# EAGLE design PiezoAmpBoard (EAGLE 7.4.0)
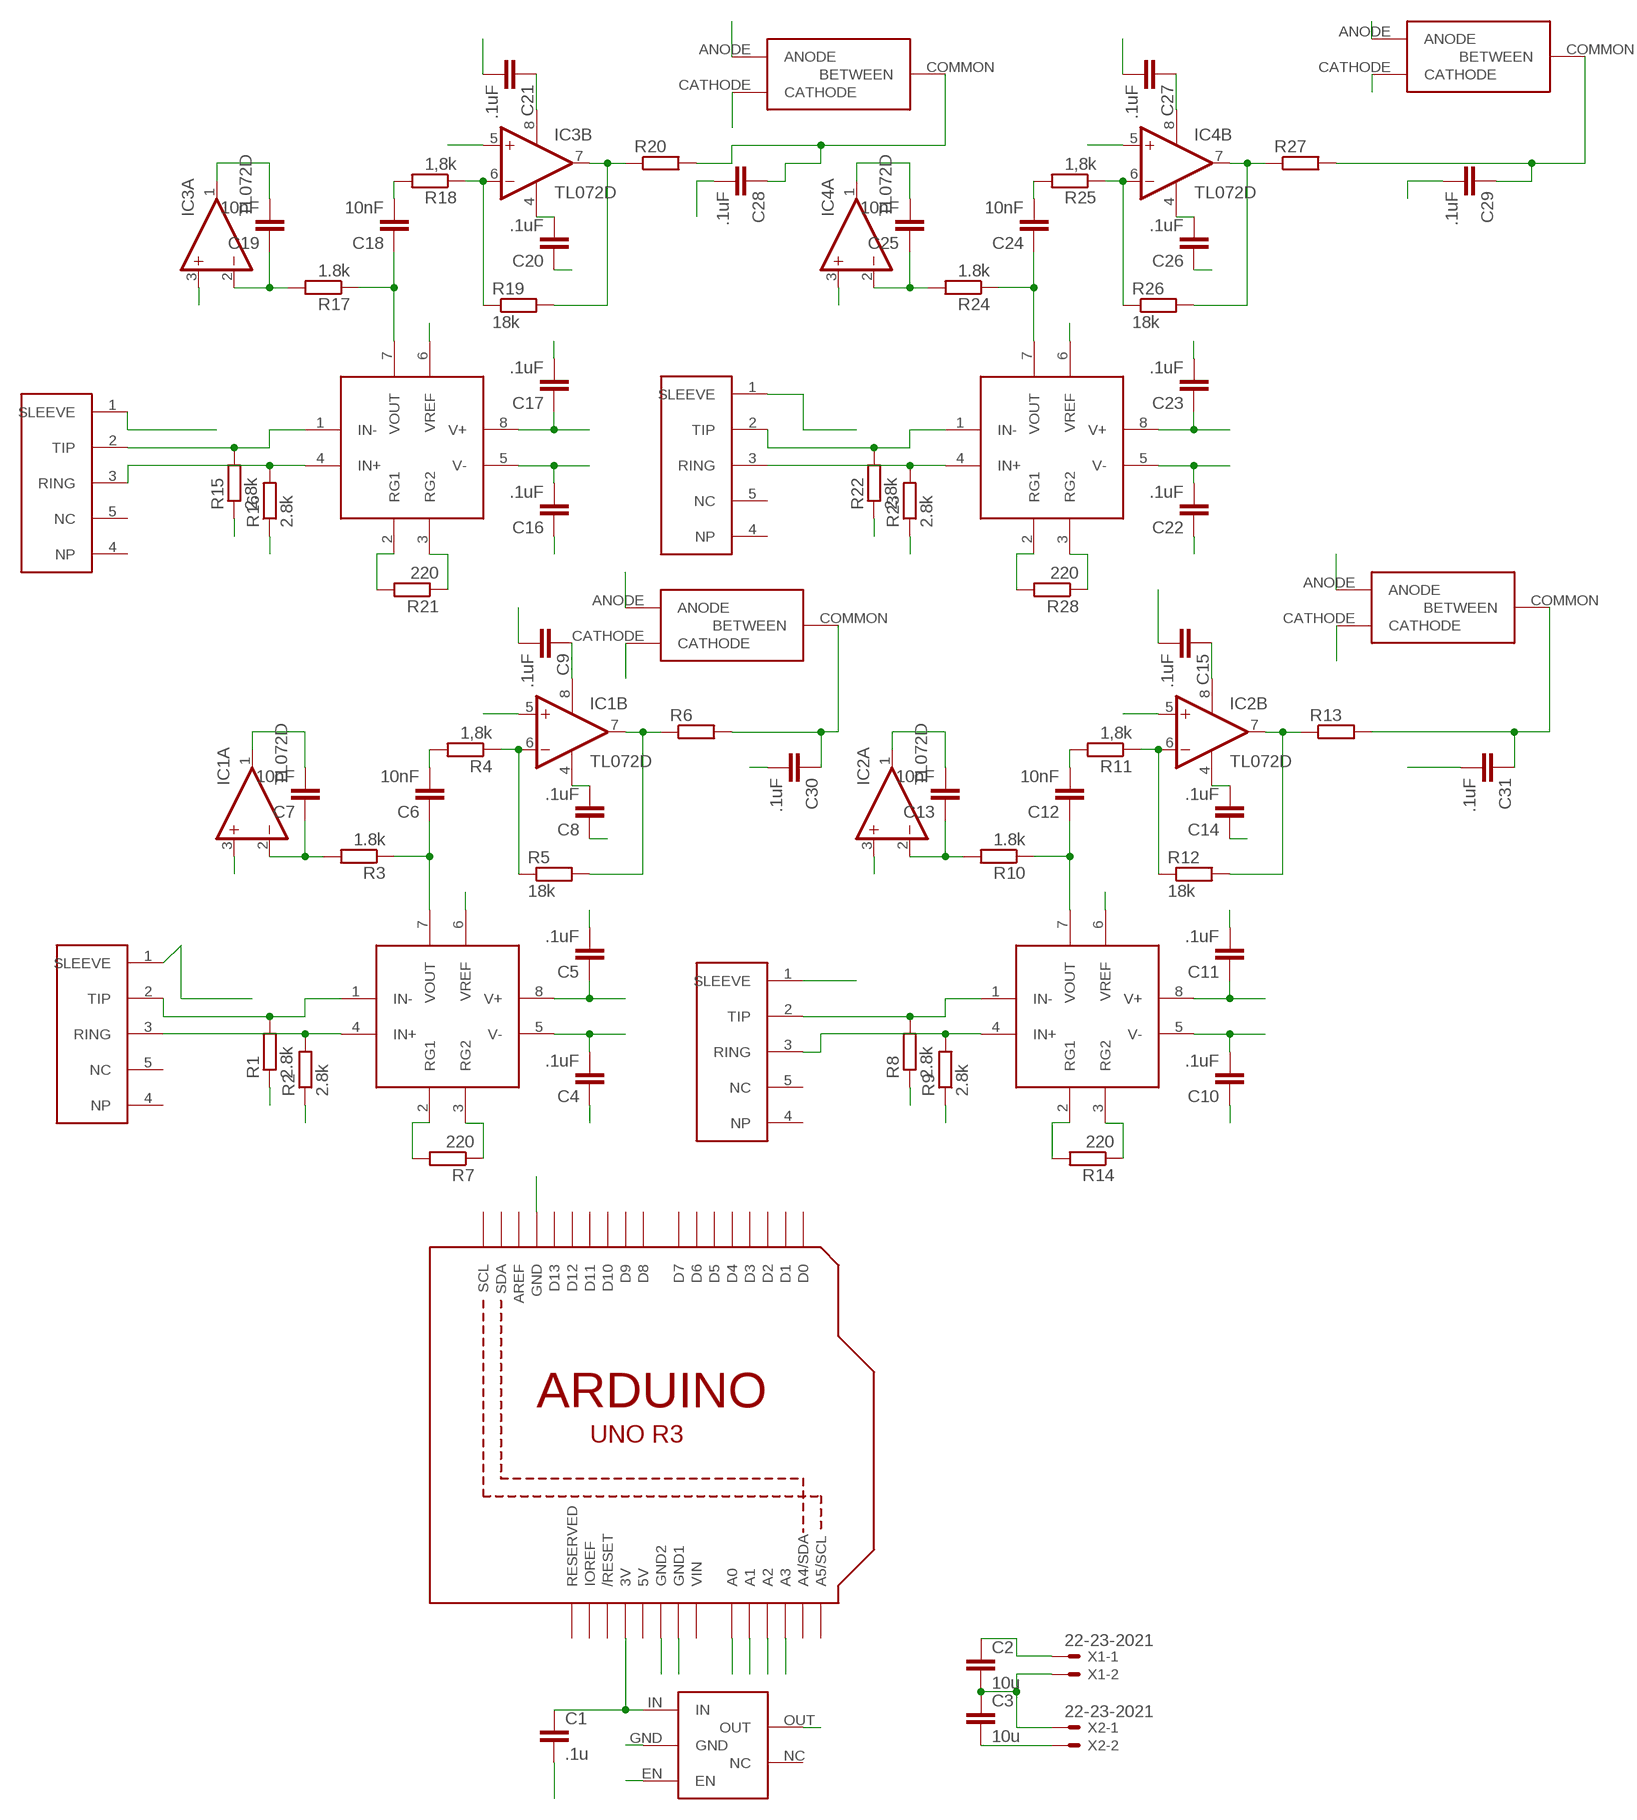
[diagram p0: schematic, sheet 1]

## Parts
C1  .1u  C-EUC0603  [C0603]
C2  10u  C-EUC0603  [C0603]
C3  10u  C-EUC0603  [C0603]
C4  .1uF  CC0603  [C0603]
C5  .1uF  CC0603  [C0603]
C6  10nF  CC0603  [C0603]
C7  10nF  CC0603  [C0603]
C8  .1uF  CC0603  [C0603]
C9  .1uF  CC0603  [C0603]
C10  .1uF  CC0603  [C0603]
C11  .1uF  CC0603  [C0603]
C12  10nF  CC0603  [C0603]
C13  10nF  CC0603  [C0603]
C14  .1uF  CC0603  [C0603]
C15  .1uF  CC0603  [C0603]
C16  .1uF  CC0603  [C0603]
C17  .1uF  CC0603  [C0603]
C18  10nF  CC0603  [C0603]
C19  10nF  CC0603  [C0603]
C20  .1uF  CC0603  [C0603]
C21  .1uF  CC0603  [C0603]
C22  .1uF  CC0603  [C0603]
C23  .1uF  CC0603  [C0603]
C24  10nF  CC0603  [C0603]
C25  10nF  CC0603  [C0603]
C26  .1uF  CC0603  [C0603]
C27  .1uF  CC0603  [C0603]
C28  .1uF  CC0603  [C0603]
C29  .1uF  CC0603  [C0603]
C30  .1uF  CC0603  [C0603]
C31  .1uF  CC0603  [C0603]
IC1  TL072D  [SO08]
IC2  TL072D  [SO08]
IC3  TL072D  [SO08]
IC4  TL072D  [SO08]
R1  2.8k  R-EU_R0603  [R0603]
R2  2.8k  R-EU_R0603  [R0603]
R3  1.8k  R-EU_R0603  [R0603]
R4  1,8k  R-EU_R0603  [R0603]
R5  18k  R-EU_R0603  [R0603]
R6  R-EU_R0603  [R0603]
R7  220  R-EU_R0603  [R0603]
R8  2.8k  R-EU_R0603  [R0603]
R9  2.8k  R-EU_R0603  [R0603]
R10  1.8k  R-EU_R0603  [R0603]
R11  1,8k  R-EU_R0603  [R0603]
R12  18k  R-EU_R0603  [R0603]
R13  R-EU_R0603  [R0603]
R14  220  R-EU_R0603  [R0603]
R15  2.8k  R-EU_R0603  [R0603]
R16  2.8k  R-EU_R0603  [R0603]
R17  1.8k  R-EU_R0603  [R0603]
R18  1,8k  R-EU_R0603  [R0603]
R19  18k  R-EU_R0603  [R0603]
R20  R-EU_R0603  [R0603]
R21  220  R-EU_R0603  [R0603]
R22  2.8k  R-EU_R0603  [R0603]
R23  2.8k  R-EU_R0603  [R0603]
R24  1.8k  R-EU_R0603  [R0603]
R25  1,8k  R-EU_R0603  [R0603]
R26  18k  R-EU_R0603  [R0603]
R27  R-EU_R0603  [R0603]
R28  220  R-EU_R0603  [R0603]
U1  ARDUINOR3-BPLACE  [ARDUINOR3-BPLACE]
U$1  TPS76316  [PDSO]
U$2  AD82216  [SOIC08]
U$3  AD82216  [SOIC08]
U$4  AD82216  [SOIC08]
U$5  AD82216  [SOIC08]
U$6  BAV99T  [SOT-523]
U$7  BAV99T  [SOT-523]
U$8  BAV99T  [SOT-523]
U$9  BAV99T  [SOT-523]
U$10  3MMJACK  [1X05]
U$11  3MMJACK  [1X05]
U$12  3MMJACK  [1X05]
U$13  3MMJACK  [1X05]
X1  22-23-2021  [22-23-2021]
X2  22-23-2021  [22-23-2021]

## Nets
3.3V: C1.1 U1.3V U$1.EN U$1.IN U$6.CATHODE U$7.CATHODE U$8.CATHODE U$9.CATHODE
GND: C1.2 U1.GND U1.GND1 U1.GND2 U$1.GND U$6.ANODE U$7.ANODE U$8.ANODE U$9.ANODE
N$1: R7.2 U$2.2(RG1)
N$2: R1.2 U$2.1(IN-) U$10.2(TIP)
N$3: R2.2 U$2.4(IN+) U$10.3(RING)
N$4: R7.1 U$2.3(RG2)
N$5: C6.1 R3.1 U$2.7(VOUT)
N$6: C7.1 IC1.2(A:-IN) R3.2
N$7: IC1.7(B:OUT) R5.2 R6.1
N$8: R8.2 U$3.1(IN-) U$13.2(TIP)
N$9: C6.2 R4.2
N$10: IC1.6(B:-IN) R4.1 R5.1
N$11: R9.2 U$3.4(IN+) U$13.3(RING)
N$12: R14.2 U$3.2(RG1)
N$13: R14.1 U$3.3(RG2)
N$14: C12.1 R10.1 U$3.7(VOUT)
N$15: C13.1 IC2.2(A:-IN) R10.2
N$16: IC2.7(B:OUT) R12.2 R13.1
N$17: C12.2 R11.2
N$18: IC2.6(B:-IN) R11.1 R12.1
N$19: R15.2 U$4.1(IN-) U$11.2(TIP)
N$20: R16.2 U$4.4(IN+) U$11.3(RING)
N$21: R21.2 U$4.2(RG1)
N$22: R21.1 U$4.3(RG2)
N$23: C18.1 R17.1 U$4.7(VOUT)
N$24: C19.1 IC3.2(A:-IN) R17.2
N$25: IC3.7(B:OUT) R19.2 R20.1
N$26: C18.2 R18.2
N$27: IC3.6(B:-IN) R18.1 R19.1
N$28: R22.2 U$5.1(IN-) U$12.2(TIP)
N$29: R23.2 U$5.4(IN+) U$12.3(RING)
N$30: R28.2 U$5.2(RG1)
N$31: R28.1 U$5.3(RG2)
N$32: C24.1 R24.1 U$5.7(VOUT)
N$33: C25.1 IC4.2(A:-IN) R24.2
N$34: IC4.7(B:OUT) R26.2 R27.1
N$35: C24.2 R25.2
N$36: IC4.6(B:-IN) R25.1 R26.1
PEIZOIN1: C28.1 R20.2 U1.A0 U$6.COMMON(BETWEEN)
PEIZOIN2: C29.1 R27.2 U1.A1 U$7.COMMON(BETWEEN)
PEIZOIN3: C31.1 R13.2 U1.A2 U$9.COMMON(BETWEEN)
PEIZOIN4: C30.1 R6.2 U1.A3 U$8.COMMON(BETWEEN)
VGND: C2.2 C3.1 C4.1 C5.2 C8.1 C9.2 C10.1 C11.2 C14.1 C15.2 C16.1 C17.2 C20.1 C21.2 C22.1 C23.2 C26.1 C27.2 C28.2 C29.2 C30.2 C31.2 IC1.3(A:+IN) IC1.5(B:+IN) IC2.3(A:+IN) IC2.5(B:+IN) IC3.3(A:+IN) IC3.5(B:+IN) IC4.3(A:+IN) IC4.5(B:+IN) R1.1 R2.1 R8.1 R9.1 R15.1 R16.1 R22.1 R23.1 U$1.OUT U$10.1(SLEEVE) U$11.1(SLEEVE) U$12.1(SLEEVE) U$13.1(SLEEVE) X1.2 X2.1
VREF: C7.2 IC1.1(A:OUT) U$2.6(VREF)
VREF1: C13.2 IC2.1(A:OUT) U$3.6(VREF)
VREF2: C19.2 IC3.1(A:OUT) U$4.6(VREF)
VREF3: C25.2 IC4.1(A:OUT) U$5.6(VREF)
VS+: C2.1 C5.1 C9.1 C11.1 C15.1 C17.1 C21.1 C23.1 C27.1 IC1.8(P:V+) IC2.8(P:V+) IC3.8(P:V+) IC4.8(P:V+) U$2.8(V+) U$3.8(V+) U$4.8(V+) U$5.8(V+) X1.1
VS-: C3.2 C4.2 C8.2 C10.2 C14.2 C16.2 C20.2 C22.2 C26.2 IC1.4(P:V-) IC2.4(P:V-) IC3.4(P:V-) IC4.4(P:V-) U$2.5(V-) U$3.5(V-) U$4.5(V-) U$5.5(V-) X2.2
Unconnected: U1.A4(A4/SDA) U1.A5(A5/SCL) U1.AREF U1.D0 U1.D1 U1.D2 U1.D3 U1.D4 U1.D5 U1.D6 U1.D7 U1.D8 U1.D9 U1.D10 U1.D11 U1.D12 U1.D13 U1.IOREF U1.RESERVED U1.RESET(/RESET) U1.SCL U1.SDA U$1.NC U$10.4(NP) U$10.5(NC) U$11.4(NP) U$11.5(NC) U$12.4(NP) U$12.5(NC) U$13.4(NP) U$13.5(NC)

## Power pins joined to a net without a drawn wire
5V: U1.5V
VIN: U1.VIN

## Library data of the parts
C1-C3 = resistor:C-EU: CAPACITOR, European symbol
C4-C31 = eagle-ltspice:C: CAPACITOR, European symbol; SPICEMODEL: NONE; SPICEPREFIX: C
IC1-IC4 = linear:TL072: OP AMP
R1-R28 = rcl:R-EU_: RESISTOR, European symbol
U1 = adafruit:ARDUINOR3: This is a new object for the new Arduino R3 - with extra pins that you may want to use (such as IOref, and duplicated A4/A5
U$1 = TPS76316:TPS76316
U$2-U$5 = AD82216:AD82216
U$6-U$9 = BAV99T:BAV99T
U$10-U$13 = 3mmJack:3MMJACK
X1 X2 = con-molex:22-23-2021: .100" (2.54mm) Center Header - 2 Pin; MF: MOLEX; MPN: 22-23-2021; OC_FARNELL: 1462926; OC_NEWARK: 25C3832

## Board
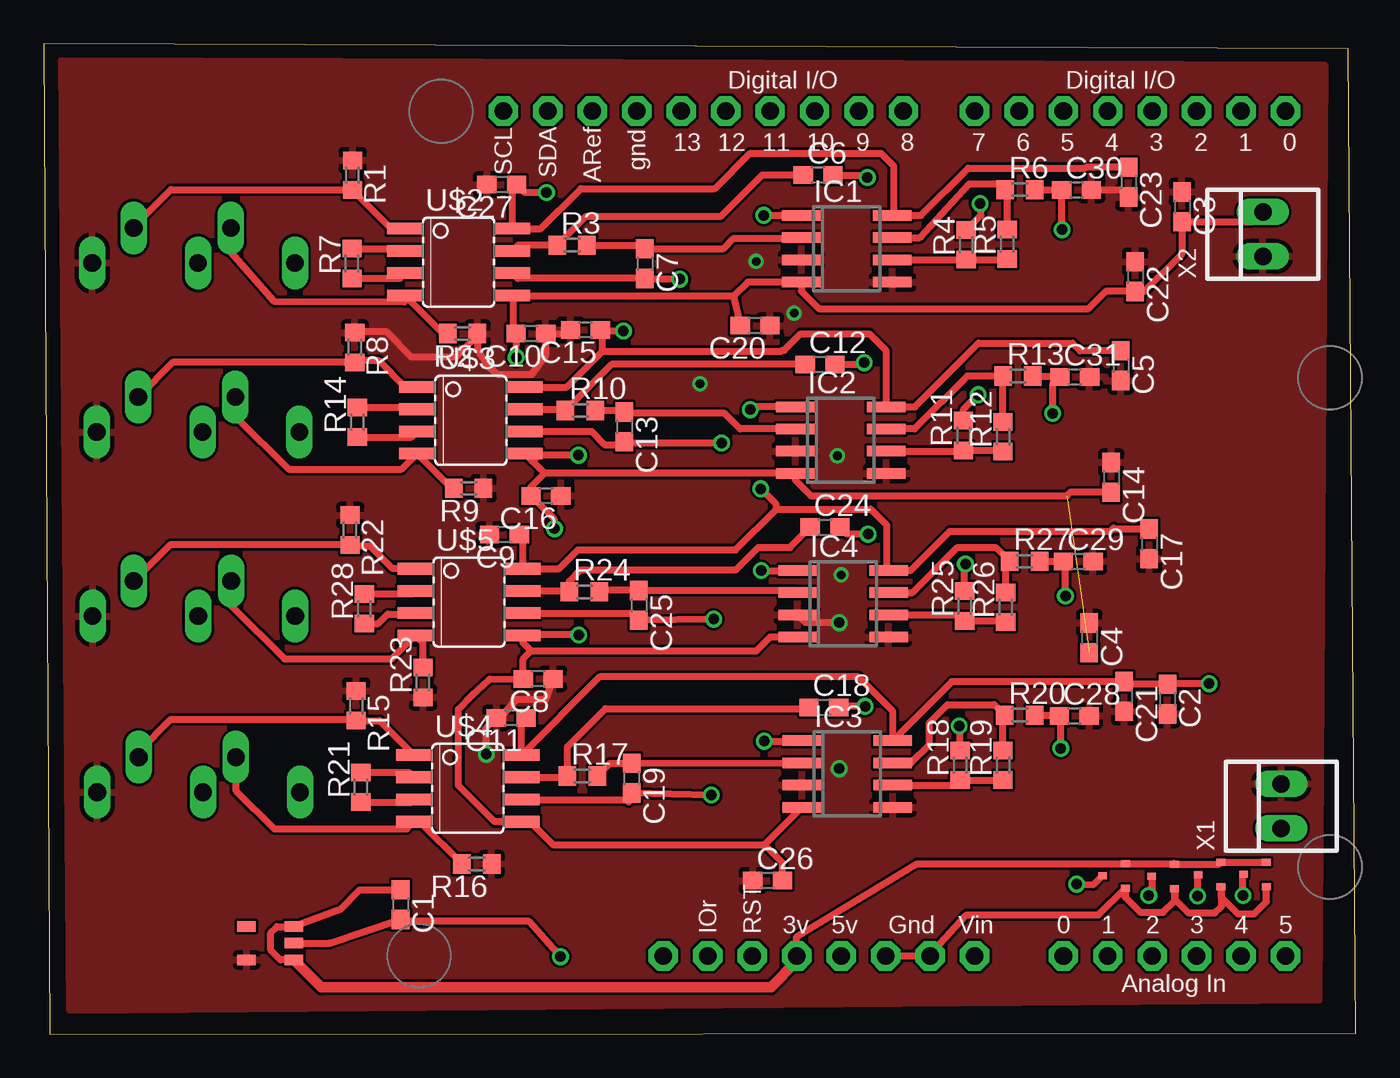
[diagram p1: board, top side]
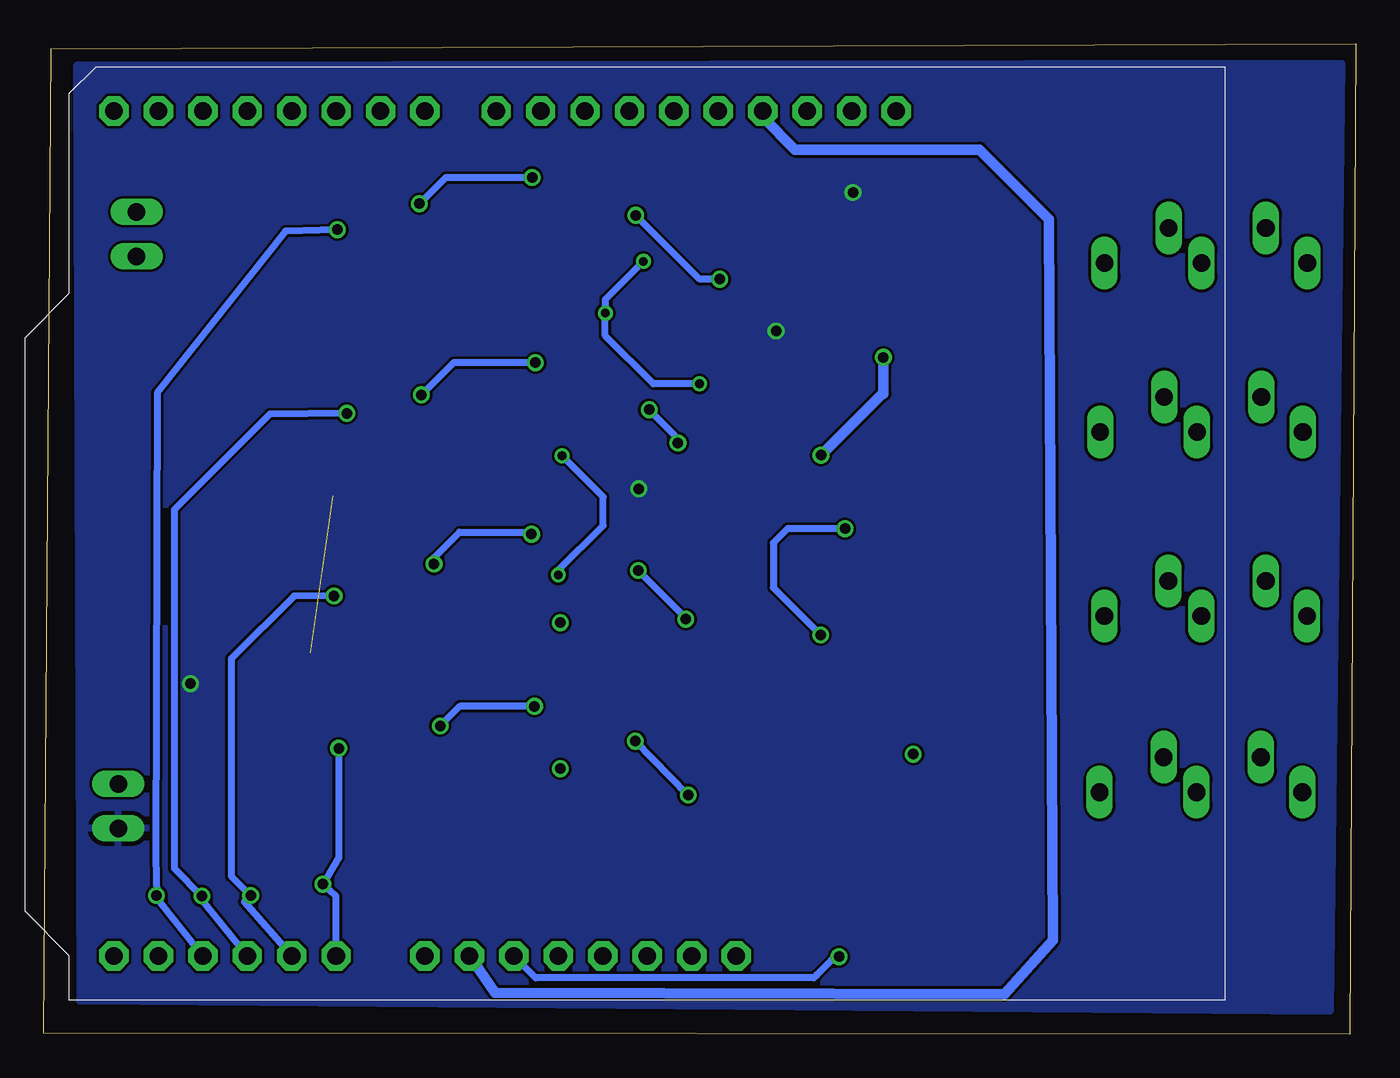
[diagram p2: board, bottom side, seen from below]

Size 74.98 x 56.58 mm. Coordinates in mm from the lower left corner, seen from the top.
Outline: 0.35,0 74.98,0.04 74.55,56.28 0,56.58 0.35,0
Copper layers (1*16): Top 0.0356mm / dielectric 1.5011mm / Bottom 0.0356mm
Design rules "OSHpark": minimum track width 6mil, minimum drill 13mil, track to track 6mil, track to pad 6mil, pad to pad 6mil, via to via 6mil, smd to smd 6mil, copper to edge 15mil, drill to drill 6mil, minimum pad ring 7mil, minimum via ring 7mil, stop-mask expansion 3mil, vias tented up to drill 0mil, thermal gap 10mil

### Footprints (pad centres in the part's own frame; a part is rotated, then mirrored left to right if it is on the bottom)
C0603 = smd 1.1 x 1: 1 -0.85,0; 2 0.85,0
SO08 = smd 0.6 x 2.2: 1 -1.905,-2.6; 2 -0.635,-2.6; 3 0.635,-2.6; 4 1.905,-2.6; 5 1.905,2.6; 6 0.635,2.6; 7 -0.635,2.6; 8 -1.905,2.6
R0603 = smd 1 x 1.1: 1 -0.85,0; 2 0.85,0
ARDUINOR3-BPLACE = drill 1 pad 1.676 octagon: 3V 35.56,2.54; 5V 38.1,2.54; A0 50.8,2.54; A1 53.34,2.54; A2 55.88,2.54; A3 58.42,2.54; A4 60.96,2.54; A5 63.5,2.54; AREF 23.876,50.8; D0 63.5,50.8; D1 60.96,50.8; D2 58.42,50.8; D3 55.88,50.8; D4 53.34,50.8; D5 50.8,50.8; D6 48.26,50.8; D7 45.72,50.8; D8 41.656,50.8; D9 39.116,50.8; D10 36.576,50.8; D11 34.036,50.8; D12 31.496,50.8; D13 28.956,50.8; GND 26.416,50.8; GND1 43.18,2.54; GND2 40.64,2.54; IOREF 30.48,2.54; RESERVED 27.94,2.54; RESET 33.02,2.54; SCL 18.796,50.8; SDA 21.336,50.8; VIN 45.72,2.54
PDSO = smd 0.6 x 1.05: EN 1.9,0; GND 0.95,0; IN 0,0; NC 1.9,2.7; OUT 0,2.7
SOIC08 = smd 0.66 x 2.032: 1 -1.905,-3.073; 2 -0.635,-3.073; 3 0.635,-3.073; 4 1.905,-3.073; 5 1.905,3.073; 6 0.635,3.073; 7 -0.635,3.073; 8 -1.905,3.073
SOT-523 = smd 0.4 x 0.5: ANODE -0.7,0; CATHODE 0.7,0; COMMON 0,1.3
1X05 = drill 1.016 long: 1 0,0; 2 2.36,2; 3 7.92,2; 4 11.58,0; 5 6.04,0
22-23-2021 = drill 1 long: 1 -1.27,0; 2 1.27,0

### Placement (x,y rotation side)
C1  20.39,7.41 270 top
C2  64.22,19.14 270 top
C3  65.05,47.27 270 top
C4  59.75,22.64 270 top
C5  61.55,38.19 270 top
C6  44.26,49.08 0 top
C7  34.36,44.02 270 top
C8  28.25,20.3 180 top
C9  26.33,28.54 180 top
C10  27.84,40.02 180 top
C11  26.72,18.07 180 top
C12  44.37,38.27 0 top
C13  33.18,34.69 270 top
C14  61.01,31.81 270 top
C15  30.96,40.24 180 top
C16  28.7,30.75 180 top
C17  63.17,28.01 270 top
C18  44.58,18.68 0 top
C19  33.6,14.63 270 top
C20  40.66,40.49 180 top
C21  61.75,19.3 270 top
C22  62.38,43.28 270 top
C23  61.99,48.68 270 top
C24  44.65,28.96 0 top
C25  34.01,24.5 270 top
C26  41.37,8.78 0 top
C27  26.18,48.54 180 top
C28  58.89,18.18 0 top
C29  59.11,27.01 0 top
C30  59.02,48.23 0 top
C31  58.92,37.55 0 top
IC1  45.89,44.87 270 top
IC2  45.55,33.94 270 top
IC3  45.92,14.87 270 top
IC4  45.67,24.59 270 top
R1  17.65,49.07 270 top
R2  23.93,40.02 180 top
R3  30.19,45.08 0 top
R4  52.71,45.1 90 top
R5  55.06,45.14 90 top
R6  55.79,48.24 0 top
R7  17.62,44.03 90 top
R8  17.78,39.24 270 top
R9  24.27,31.19 180 top
R10  30.67,35.64 0 top
R11  52.56,34.2 90 top
R12  54.82,34.13 90 top
R13  55.68,37.6 0 top
R14  17.92,34.96 90 top
R15  17.85,18.77 270 top
R16  24.75,9.73 180 top
R17  30.78,14.75 0 top
R18  52.37,15.36 90 top
R19  54.82,15.36 90 top
R20  55.78,18.22 0 top
R21  18.13,14.11 90 top
R22  17.5,28.81 270 top
R23  21.67,20.09 90 top
R24  30.9,25.27 0 top
R25  52.63,24.46 90 top
R26  54.98,24.39 90 top
R27  56.05,27.02 0 top
R28  18.33,24.3 90 top
U1  7.47,1.93 0 top
U$1  14.29,4.25 90 top
U$2  23.71,44.11 270 top
U$3  24.41,35.07 270 top
U$4  24.23,14.04 270 top
U$5  24.31,24.69 270 top
U$6  61.81,9.05 90 top
U$7  64.62,9.02 90 top
U$8  69.86,9.13 90 top
U$9  67.27,9.12 90 top
U$10  2.77,44.06 0 top
U$11  3.06,13.83 0 top
U$12  2.79,23.89 0 top
U$13  3.03,34.4 0 top
X1  70.72,13.03 90 top
X2  69.67,45.71 90 top

### Tracks (layer width: path | path; a pad name or v marks a point on that pad's centre or on a via)
3.3V
  Top 0.406: C1.1 20.38,8.24 18.07,8.24 16.99,7.16 U$1.EN 13.33,6.15 12.98,5.8 12.98,4.8 13.52,4.25 U$1.IN | U1.3V 43.03,5.56 49.9,9.73 61.79,9.73 U$6.CATHODE 64.59,9.75 U$7.CATHODE 67.17,9.72 U$9.CATHODE U$8.CATHODE
  Top 0.61: U1.3V 43.03,4.16 41.55,2.67 15.87,2.67 U$1.IN
GND  (via drill 0.6)
  Top 0.406: U1.GND2 U1.GND1 50.59,4.49 52.74,6.82 60.28,6.82 U$6.ANODE 61.81,7.84 62.68,6.96 63.96,6.96 64.66,7.66 64.66,8.27 U$7.ANODE 64.62,7.74 65.42,6.93 66.93,6.93 67.31,7.31 67.31,8.38 U$9.ANODE 67.27,7.85 68.24,6.88 69.18,6.88 69.87,7.57 U$8.ANODE | v29.53,4.43 27.72,6.45 20.5,6.45 C1.2 16.34,5.2 U$1.GND
  Bottom 0.406: v29.53,4.43 29.96,4.24 30.79,3.41 30.8,3.41 30.98,3.22 46.86,3.22 U1.GND2
  Bottom 0.61: U1.GND 33.89,52.39 32.04,50.54 21.51,50.54 17.54,46.57 17.32,5.38 20.09,2.29 49.19,2.38 U1.GND1
N$1
  Top 0.406: R7.2 20.5,44.88 U$2.2
N$2
  Top 0.406: U$2.1 19.85,46.02 R1.2 17.62,48.25 7.26,48.25 5.13,46.12 U$10.2
N$3
  Top 0.406: R2.2 22.82,40.02 U$2.4 20.61,41.84 13.17,41.87 10.69,44.7 U$10.3
N$4
  Top 0.406: R7.1 20.34,43.18 U$2.3
N$5
  Top 0.406: U$2.7 27.11,45.08 R3.1 30.97,46.71 38.67,46.71 41.05,49.08 C6.1
N$6
  Top 0.406: R3.2 34.15,45.08 C7.1 38.83,44.87 39.42,45.46 43.25,45.46 IC1.2
N$7
  Top 0.406: R5.2 55.06,48.13 R6.1 54.97,48.58 52.9,48.58 50.07,45.5 IC1.7
N$8
  Top 0.406: R8.2 17.22,38.39 | U$3.1 20.64,36.97 19.15,38.46 17.3,38.46 17.22,38.39 | 17.22,38.39 7.38,38.39 U$13.2
N$9  (via drill 0.6)
  Top 0.406: C6.2 46.93,49.08 v47.07,48.94 | R4.2 53.57,46.79 53.57,47.39 v53.51,47.45
  Bottom 0.406: v47.07,48.94 52.01,48.94 v53.51,47.45
N$10
  Top 0.406: IC1.6 52.7,44.23 R4.1 55.02,44.25 R5.1
N$11
  Top 0.406: R9.2 23.31,31.19 U$3.4 20.45,32.28 13.99,32.28 10.95,35.31 U$13.3
N$12
  Top 0.406: R14.2 20.77,35.81 21.23,35.81 U$3.2
N$13
  Top 0.406: R14.1 21.01,34.11 U$3.3
N$14
  Top 0.406: U$3.7 29.75,35.7 R10.1 32.45,38.26 C12.1
N$15
  Top 0.406: R10.2 33.08,35.64 C13.1 33.26,35.46 38.92,35.46 39.8,34.57 IC2.2
N$16
  Top 0.406: R12.2 54.82,37.59 R13.1 52.78,37.6 49.77,34.59 48.16,34.59 IC2.7
N$17  (via drill 0.6)
  Top 0.406: C12.2 46.78,38.26 v46.88,38.36 | R11.2 52.56,35.7 v53.39,36.53
  Bottom 0.406: v46.88,38.36 51.55,38.36 v53.39,36.53
N$18
  Top 0.406: IC2.6 52.52,33.3 R11.1 54.74,33.35 R12.1
N$19
  Top 0.406: U$4.1 19.19,17.92 R15.2 17.79,17.98 7.26,17.98 5.42,16.14 U$11.2
N$20
  Top 0.406: R16.2 21.49,12.14 U$4.4 20.75,11.72 13.17,11.72 10.98,13.91 U$11.3
N$21
  Top 0.406: R21.2 20.87,14.96 U$4.2
N$22
  Top 0.406: R21.1 21.02,13.26 U$4.3
N$23
  Top 0.406: U$4.7 29.86,14.68 R17.1 29.93,16.42 32.1,18.59 43.64,18.59 C18.1
N$24
  Top 0.406: R17.2 32.36,15.48 C19.1 IC3.2
N$25
  Top 0.406: R19.2 54.82,18.11 R20.1 54.33,18.83 51.65,18.83 50.61,17.79 50.61,16.55 49.57,15.5 IC3.7
N$26  (via drill 0.6)
  Top 0.406: v46.93,18.73 45.48,18.73 C18.2 | R18.2 52.37,17.56 v52.32,17.61
  Bottom 0.406: v46.93,18.73 51.2,18.73 v52.32,17.61
N$27
  Top 0.406: IC3.6 52.09,14.23 R18.1 R19.1
N$28
  Top 0.406: U$5.1 19.95,26.59 18.66,27.88 17.59,27.88 R22.2 7.22,27.96 U$12.2
N$29
  Top 0.406: R23.2 21.67,22.34 U$5.4 19.89,21.44 13.75,21.44 10.71,24.49 U$12.3
N$30
  Top 0.406: R28.2 21.06,25.15 U$5.2
N$31
  Top 0.406: R28.1 19.11,23.45 19.66,24 21.18,24 U$5.3
N$32
  Top 0.406: U$5.7 30,25.32 R24.1 30.05,25.88 30.69,26.53 39.55,26.53 40.83,27.81 42.65,27.81 C24.1
N$33
  Top 0.406: IC4.2 42.94,25.35 C25.1 31.83,25.35 R24.2
N$34
  Top 0.406: R26.2 54.98,26.79 R27.1 54.41,27.81 52.22,27.81 49.63,25.22 IC4.7
N$35  (via drill 0.6)
  Top 0.406: v47.11,28.56 45.9,28.56 C24.2 | R25.2 52.63,26.81 v52.68,26.86
  Bottom 0.406: v52.68,26.86 52.68,27.23 51.23,28.68 47.22,28.68 v47.11,28.56
N$36
  Top 0.406: IC4.6 52.28,23.95 R25.1 54.91,23.61 R26.1
PEIZOIN1  (via drill 0.6)
  Top 0.406: R20.2 56.67,18.18 C28.1 58.13,18.1 v58.13,16.33 | v59.02,8.57 59.98,8.55 U$6.COMMON
  Bottom 0.406: U1.A0 58.27,7.89 v59.02,8.57 58.13,10.08 v58.13,16.33
PEIZOIN2  (via drill 0.6)
  Top 0.406: U$7.COMMON 63.32,8.09 v63.15,7.92 | R27.2 C29.1 58.39,26.89 v58.39,25.04
  Bottom 0.406: U1.A1 63.51,7.56 v63.15,7.92 64.26,9.03 64.26,21.45 60.68,25.03 v58.39,25.04
PEIZOIN3  (via drill 0.6)
  Top 0.406: v65.94,7.89 65.94,9.09 U$9.COMMON | R13.2 58.02,37.6 C31.1 57.66,37.15 v57.66,35.47
  Bottom 0.406: U1.A2 66.05,7.79 v65.94,7.89 67.52,9.47 67.52,29.97 62.07,35.42 v57.66,35.47
PEIZOIN4  (via drill 0.6)
  Top 0.406: v68.54,7.92 68.54,9.1 U$8.COMMON | R6.2 58.16,48.24 C30.1 58.2,48.17 v58.2,45.96
  Bottom 0.406: U1.A3 68.59,7.87 v68.54,7.92 68.58,10.1 68.49,36.64 61.16,45.89 v58.2,45.96
VGND  (via drill 0.5, 0.6)
  Top 0.406: C15.2 29.9,40.02 C10.1 28.7,40.01 28.7,38.79 27.91,37.7 25.9,37.7 25.47,38.08 25.45,38.1 24.78,39.07 R2.1 24.78,39.94 23.53,38.69 21.02,38.69 19.59,40.12 17.81,40.12 R8.1 | v25.29,16 25.29,17.49 C11.2 26.09,18.07 26.99,19.12 28.7,19.12 C8.1 | v45.45,23.51 43.52,23.51 IC4.3 | C30.2 61.59,48.23 C23.2
  Bottom 0.406: v40.72,44.15 42.89,41.98 v42.89,41.19 v42.9,41.18 42.9,39.92 40.14,37.15 v37.5,37.15 | v45.57,26.24 45.57,26.49 43.01,29.06 43.01,30.69 v45.36,33.04
  other vias: 45.45,15.17
  pour Top: 1.49,1.34 1.02,55.65 73.2,55.38 72.88,1.93
VREF  (via drill 0.6)
  Top 0.406: U$2.6 27.09,43.17 C7.2 34.4,43.13 v36.35,43.13 | v41.15,46.79 43.28,46.79 IC1.1
  Bottom 0.406: v36.35,43.13 37.5,43.13 v41.15,46.79
VREF1  (via drill 0.6)
  Top 0.406: IC2.1 40.54,35.84 v40.38,35.68 | U$3.6 31.31,34.43 32.06,33.68 33.03,33.68 C13.2 33.25,33.77 v38.74,33.77
  Bottom 0.406: v38.74,33.77 38.47,33.77 v40.38,35.68
VREF2  (via drill 0.6)
  Top 0.406: U$4.6 33.46,13.41 C19.2 | v41.17,16.74 42.7,16.74 42.74,16.79 43.3,16.79 IC3.1 | C19.2 33.42,13.27 33.33,13.36 | v38.15,13.67 C19.2
  Bottom 0.406: v38.15,13.67 v41.17,16.74
VREF3  (via drill 0.6)
  Top 0.406: U$5.6 33.61,24.05 C25.2 v38.28,23.71 | v41,26.48 42.16,26.48 42.24,26.4 42.98,26.4 IC4.1
  Bottom 0.406: v38.28,23.71 38.23,23.71 v41,26.48
VS+  (via drill 0.6)
  Top 0.406: 41.87,29.99 39.55,27.67 30.53,27.67 29.45,26.59 U$5.8 27.38,28.34 C9.1 | 41.87,29.99 47.27,29.99 48.16,29.1 48.16,26.61 IC4.8 49.55,26.49 51.78,28.73 60.95,28.73 61.15,28.93 61.22,28.86 C17.1 | U$3.8 29.89,36.97 31.93,39.01 | 31.93,39.01 42.11,39.01 42.16,39.06 42.31,39.06 43.26,40 47.18,40 48.13,39.06 48.13,35.87 IC2.8 49.79,35.84 50.03,36.08 53.43,39.48 58.79,39.48 59.24,39.04 C5.1 | 31.93,40.13 C15.1 | C11.1 27.31,17.81 U$4.8 31.77,20.41 46.55,20.41 48.52,18.45 IC3.8 51.89,20.15 C21.1 61.9,19.99 C2.1 64.25,20.02 v66.6,20.02 | 31.93,39.01 31.93,40.12 C15.1 | C23.1 59.56,49.53 59.51,49.47 52.84,49.47 50.14,46.77 IC1.8 48.56,46.85 48.56,49.61 47.84,50.32 40.37,50.32 38.36,48.31 30.7,48.31 28.4,46.02 U$2.8 26.78,48.29 C27.1 27.48,48.08 v28.73,48.08 | 41.87,29.99 41.87,30.27 v40.98,31.16 | v33.13,40.17 31.88,40.17 C15.1
  pour Bottom: 1.46,1.29 72.91,1.88 73.09,55.38 0.8,55.49
VS-  (via drill 0.6)  (1 unrouted)
  Top 0.406: 39.43,42.16 40.24,42.96 IC1.4 43.29,42.45 44.3,41.45 59.7,41.45 60.69,42.43 C22.2 62.9,42.43 65.06,44.6 65.06,46.41 C3.2 69.11,46.42 X2.2 | 39.43,42.16 26.83,42.16 | 26.83,42.16 U$2.5 | 28.61,32.03 IC2.4 42.95,31.66 43.86,30.75 58.47,30.75 58.68,30.96 C14.2 | 28.61,32.03 27.93,32.72 | 27.93,32.72 U$3.5 | 26.83,42.16 26.83,40.18 C10.2 27.03,39.98 v27,38.67 | 41.18,10.83 29.1,10.83 27.78,12.14 U$4.5 25.76,12.14 23.7,14.2 23.7,18.57 24.48,19.35 25.49,20.28 C8.2 27.4,21.45 27.85,21.9 | 41.18,10.83 IC3.4 | 28.61,32.03 27.85,31.27 C16.2 29.19,29.41 v29.19,28.88 | v30.56,33.08 28.28,33.08 27.93,32.72 | v30.58,22.81 27.41,22.81 U$5.5 27.38,22.37 27.85,21.9 | 27.85,21.9 40.73,21.9 41.52,22.69 43.07,22.69 IC4.4 | C26.2 42.22,9.79 41.18,10.83 | 39.43,42.16 C20.2
  Top 0.61: 27.05,39.96 C10.2
  Bottom 0.406: v29.19,28.88 32.47,28.88 33.28,28.06 33.28,25.51 v30.58,22.81
  Bottom 0.61: v30.56,33.08 27.05,36.59 26.99,36.59 26.99,38.16 v27,38.67